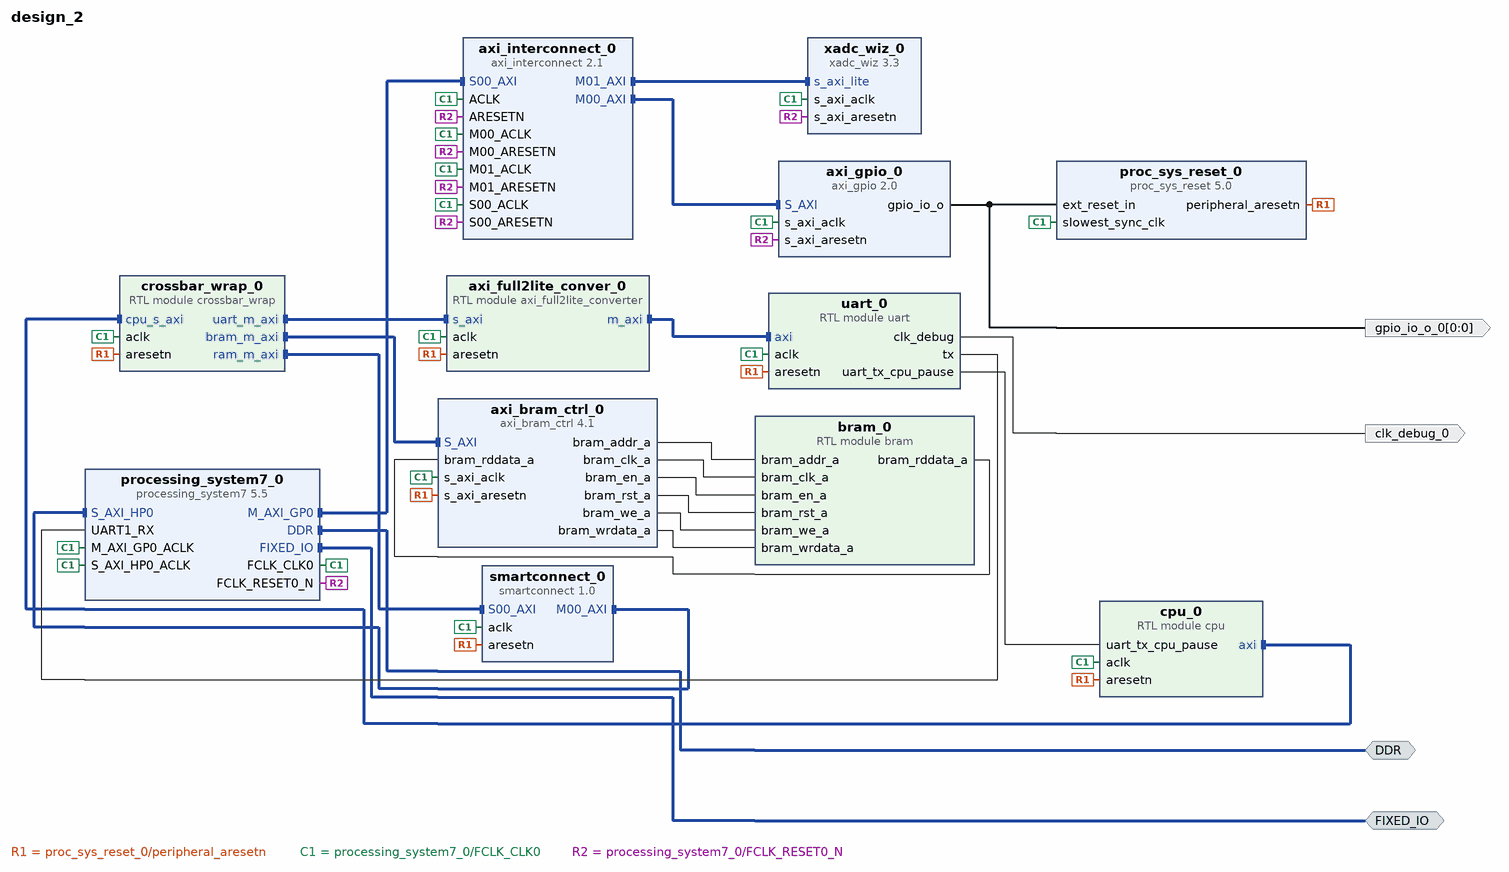
[diagram p0: block diagram of the top level]
# Vivado block design design_2, xc7z020clg400-1, Vivado 2022.2
create_bd_design design_2

create_bd_intf_port -mode Master -vlnv xilinx.com:interface:ddrx_rtl:1.0 DDR
create_bd_intf_port -mode Master -vlnv xilinx.com:display_processing_system7:fixedio_rtl:1.0 FIXED_IO
create_bd_port -dir O clk_debug_0
create_bd_port -dir O -from 0 -to 0 gpio_io_o_0

create_bd_cell -type ip -vlnv xilinx.com:ip:processing_system7:5.5 processing_system7_0
set_property -dict [list \
  CONFIG.PCW_APU_PERIPHERAL_FREQMHZ 650 \
  CONFIG.PCW_CRYSTAL_PERIPHERAL_FREQMHZ 50 \
  CONFIG.PCW_ENET0_PERIPHERAL_ENABLE 0 \
  CONFIG.PCW_FPGA0_PERIPHERAL_FREQMHZ 57.1 \
  CONFIG.PCW_FPGA1_PERIPHERAL_FREQMHZ 50 \
  CONFIG.PCW_GPIO_MIO_GPIO_ENABLE 1 \
  CONFIG.PCW_GPIO_MIO_GPIO_IO MIO \
  CONFIG.PCW_I2C_RESET_ENABLE 1 \
  CONFIG.PCW_PERIPHERAL_BOARD_PRESET None \
  CONFIG.PCW_PRESET_BANK1_VOLTAGE {LVCMOS 1.8V} \
  CONFIG.PCW_QSPI_PERIPHERAL_ENABLE 0 \
  CONFIG.PCW_SD0_GRP_CD_ENABLE 1 \
  CONFIG.PCW_SD0_GRP_CD_IO {MIO 47} \
  CONFIG.PCW_SD0_GRP_WP_ENABLE 0 \
  CONFIG.PCW_SD0_PERIPHERAL_ENABLE 1 \
  CONFIG.PCW_SD0_SD0_IO {MIO 40 .. 45} \
  CONFIG.PCW_SDIO_PERIPHERAL_FREQMHZ 50 \
  CONFIG.PCW_S_AXI_HP0_DATA_WIDTH 32 \
  CONFIG.PCW_UART0_PERIPHERAL_ENABLE 1 \
  CONFIG.PCW_UART0_UART0_IO {MIO 14 .. 15} \
  CONFIG.PCW_UART1_PERIPHERAL_ENABLE 1 \
  CONFIG.PCW_UART1_UART1_IO EMIO \
  CONFIG.PCW_UART_PERIPHERAL_FREQMHZ 100 \
  CONFIG.PCW_UIPARAM_DDR_BUS_WIDTH {16 Bit} \
  CONFIG.PCW_UIPARAM_DDR_FREQ_MHZ 525 \
  CONFIG.PCW_UIPARAM_DDR_PARTNO {MT41J256M16 RE-125} \
  CONFIG.PCW_USB0_PERIPHERAL_ENABLE 0 \
  CONFIG.PCW_USB_RESET_ENABLE 1 \
  CONFIG.PCW_USE_S_AXI_HP0 1 \
] [get_bd_cells processing_system7_0]
# 489 more settings of processing_system7_0 are not shown: defaults, MIO pin electricals, DDR timing, and values the tool derives
create_bd_cell -type ip -vlnv xilinx.com:ip:proc_sys_reset:5.0 proc_sys_reset_0
create_bd_cell -type module -reference crossbar_wrap crossbar_wrap_0
create_bd_cell -type ip -vlnv xilinx.com:ip:axi_bram_ctrl:4.1 axi_bram_ctrl_0
set_property -dict {CONFIG.SINGLE_PORT_BRAM 1} [get_bd_cells axi_bram_ctrl_0]
create_bd_cell -type module -reference axi_full2lite_converter axi_full2lite_conver_0
create_bd_cell -type ip -vlnv xilinx.com:ip:smartconnect:1.0 smartconnect_0
set_property -dict {CONFIG.NUM_SI 1} [get_bd_cells smartconnect_0]
create_bd_cell -type ip -vlnv xilinx.com:ip:xadc_wiz:3.3 xadc_wiz_0
set_property -dict [list \
  CONFIG.CHANNEL_AVERAGING 256 \
  CONFIG.CHANNEL_ENABLE_VBRAM true \
  CONFIG.CHANNEL_ENABLE_VCCINT true \
  CONFIG.CHANNEL_ENABLE_VP_VN false \
  CONFIG.EXTERNAL_MUX_CHANNEL VP_VN \
  CONFIG.SEQUENCER_MODE Continuous \
  CONFIG.SINGLE_CHANNEL_SELECTION TEMPERATURE \
  CONFIG.XADC_STARUP_SELECTION channel_sequencer \
] [get_bd_cells xadc_wiz_0]
create_bd_cell -type ip -vlnv xilinx.com:ip:axi_interconnect:2.1 axi_interconnect_0
create_bd_cell -type ip -vlnv xilinx.com:ip:axi_gpio:2.0 axi_gpio_0
set_property -dict {CONFIG.C_ALL_OUTPUTS 1 CONFIG.C_GPIO_WIDTH 1} [get_bd_cells axi_gpio_0]
create_bd_cell -type module -reference bram bram_0
set_property -dict {CONFIG.select_app boot} [get_bd_cells bram_0]
create_bd_cell -type module -reference uart uart_0
set_property -dict {CONFIG.clock_frequency 57100000} [get_bd_cells uart_0]
create_bd_cell -type module -reference cpu cpu_0
set_property -dict [list \
  CONFIG.alu_type DEFAULT \
  CONFIG.cache_address_width 32 \
  CONFIG.cache_enable True \
  CONFIG.cache_index_width 6 \
  CONFIG.cache_offset_width 5 \
  CONFIG.cache_replace_policy RR \
  CONFIG.cache_way_width 1 \
  CONFIG.mult_type DEFAULT \
  CONFIG.shifter_type DEFAULT \
] [get_bd_cells cpu_0]

# ---- connections ----

connect_bd_intf_net [get_bd_intf_pins uart_0/axi] [get_bd_intf_pins axi_full2lite_conver_0/m_axi]
connect_bd_intf_net [get_bd_intf_pins axi_interconnect_0/M00_AXI] [get_bd_intf_pins axi_gpio_0/S_AXI]
connect_bd_intf_net [get_bd_intf_pins axi_interconnect_0/M01_AXI] [get_bd_intf_pins xadc_wiz_0/s_axi_lite]
connect_bd_intf_net [get_bd_intf_pins cpu_0/axi] [get_bd_intf_pins crossbar_wrap_0/cpu_s_axi]
connect_bd_intf_net [get_bd_intf_pins crossbar_wrap_0/bram_m_axi] [get_bd_intf_pins axi_bram_ctrl_0/S_AXI]
connect_bd_intf_net [get_bd_intf_pins crossbar_wrap_0/ram_m_axi] [get_bd_intf_pins smartconnect_0/S00_AXI]
connect_bd_intf_net [get_bd_intf_pins crossbar_wrap_0/uart_m_axi] [get_bd_intf_pins axi_full2lite_conver_0/s_axi]
connect_bd_intf_net [get_bd_intf_ports DDR] [get_bd_intf_pins processing_system7_0/DDR]
connect_bd_intf_net [get_bd_intf_ports FIXED_IO] [get_bd_intf_pins processing_system7_0/FIXED_IO]
connect_bd_intf_net [get_bd_intf_pins processing_system7_0/M_AXI_GP0] [get_bd_intf_pins axi_interconnect_0/S00_AXI]
connect_bd_intf_net [get_bd_intf_pins smartconnect_0/M00_AXI] [get_bd_intf_pins processing_system7_0/S_AXI_HP0]
connect_bd_net [get_bd_pins axi_bram_ctrl_0/bram_addr_a] [get_bd_pins bram_0/bram_addr_a]
connect_bd_net [get_bd_pins axi_bram_ctrl_0/bram_clk_a] [get_bd_pins bram_0/bram_clk_a]
connect_bd_net [get_bd_pins axi_bram_ctrl_0/bram_en_a] [get_bd_pins bram_0/bram_en_a]
connect_bd_net [get_bd_pins axi_bram_ctrl_0/bram_rst_a] [get_bd_pins bram_0/bram_rst_a]
connect_bd_net [get_bd_pins axi_bram_ctrl_0/bram_we_a] [get_bd_pins bram_0/bram_we_a]
connect_bd_net [get_bd_pins axi_bram_ctrl_0/bram_wrdata_a] [get_bd_pins bram_0/bram_wrdata_a]
connect_bd_net [get_bd_pins axi_gpio_0/gpio_io_o] [get_bd_ports gpio_io_o_0] [get_bd_pins proc_sys_reset_0/ext_reset_in]
connect_bd_net [get_bd_pins bram_0/bram_rddata_a] [get_bd_pins axi_bram_ctrl_0/bram_rddata_a]
connect_bd_net [get_bd_pins proc_sys_reset_0/peripheral_aresetn] \
  [get_bd_pins axi_full2lite_conver_0/aresetn] [get_bd_pins smartconnect_0/aresetn] [get_bd_pins crossbar_wrap_0/aresetn] \
  [get_bd_pins axi_bram_ctrl_0/s_axi_aresetn] [get_bd_pins uart_0/aresetn] [get_bd_pins cpu_0/aresetn]
connect_bd_net [get_bd_pins processing_system7_0/FCLK_CLK0] \
  [get_bd_pins proc_sys_reset_0/slowest_sync_clk] [get_bd_pins processing_system7_0/S_AXI_HP0_ACLK] \
  [get_bd_pins crossbar_wrap_0/aclk] [get_bd_pins axi_bram_ctrl_0/s_axi_aclk] [get_bd_pins axi_full2lite_conver_0/aclk] \
  [get_bd_pins smartconnect_0/aclk] [get_bd_pins xadc_wiz_0/s_axi_aclk] [get_bd_pins axi_gpio_0/s_axi_aclk] \
  [get_bd_pins processing_system7_0/M_AXI_GP0_ACLK] [get_bd_pins axi_interconnect_0/ACLK] \
  [get_bd_pins axi_interconnect_0/M00_ACLK] [get_bd_pins axi_interconnect_0/M01_ACLK] \
  [get_bd_pins axi_interconnect_0/S00_ACLK] [get_bd_pins uart_0/aclk] [get_bd_pins cpu_0/aclk]
connect_bd_net [get_bd_pins processing_system7_0/FCLK_RESET0_N] \
  [get_bd_pins xadc_wiz_0/s_axi_aresetn] [get_bd_pins axi_gpio_0/s_axi_aresetn] [get_bd_pins axi_interconnect_0/M01_ARESETN] \
  [get_bd_pins axi_interconnect_0/M00_ARESETN] [get_bd_pins axi_interconnect_0/S00_ARESETN] \
  [get_bd_pins axi_interconnect_0/ARESETN]
connect_bd_net [get_bd_pins uart_0/clk_debug] [get_bd_ports clk_debug_0]
connect_bd_net [get_bd_pins uart_0/tx] [get_bd_pins processing_system7_0/UART1_RX]
connect_bd_net [get_bd_pins uart_0/uart_tx_cpu_pause] [get_bd_pins cpu_0/uart_tx_cpu_pause]

# ---- address map ----
assign_bd_address -offset 0x20000000 -range 64K -target_address_space [get_bd_addr_spaces axi_full2lite_conver_0/m_axi] [get_bd_addr_segs uart_0/axi/reg0]
assign_bd_address -offset 0x00000000 -range 8K -target_address_space [get_bd_addr_spaces crossbar_wrap_0/bram_m_axi] [get_bd_addr_segs axi_bram_ctrl_0/S_AXI/Mem0]
assign_bd_address -offset 0x10000000 -range 32M -target_address_space [get_bd_addr_spaces crossbar_wrap_0/ram_m_axi] [get_bd_addr_segs processing_system7_0/S_AXI_HP0/HP0_DDR_LOWOCM]
assign_bd_address -offset 0x20000000 -range 64K -target_address_space [get_bd_addr_spaces crossbar_wrap_0/uart_m_axi] [get_bd_addr_segs axi_full2lite_conver_0/s_axi/reg0]
assign_bd_address -offset 0x41200000 -range 64K -target_address_space [get_bd_addr_spaces processing_system7_0/Data] [get_bd_addr_segs axi_gpio_0/S_AXI/Reg]
assign_bd_address -offset 0x43C00000 -range 64K -target_address_space [get_bd_addr_spaces processing_system7_0/Data] [get_bd_addr_segs xadc_wiz_0/s_axi_lite/Reg]

validate_bd_design
save_bd_design
